# EAGLE schematic vr60 (EAGLE 9.6.2)

## Sheet 1 of 2
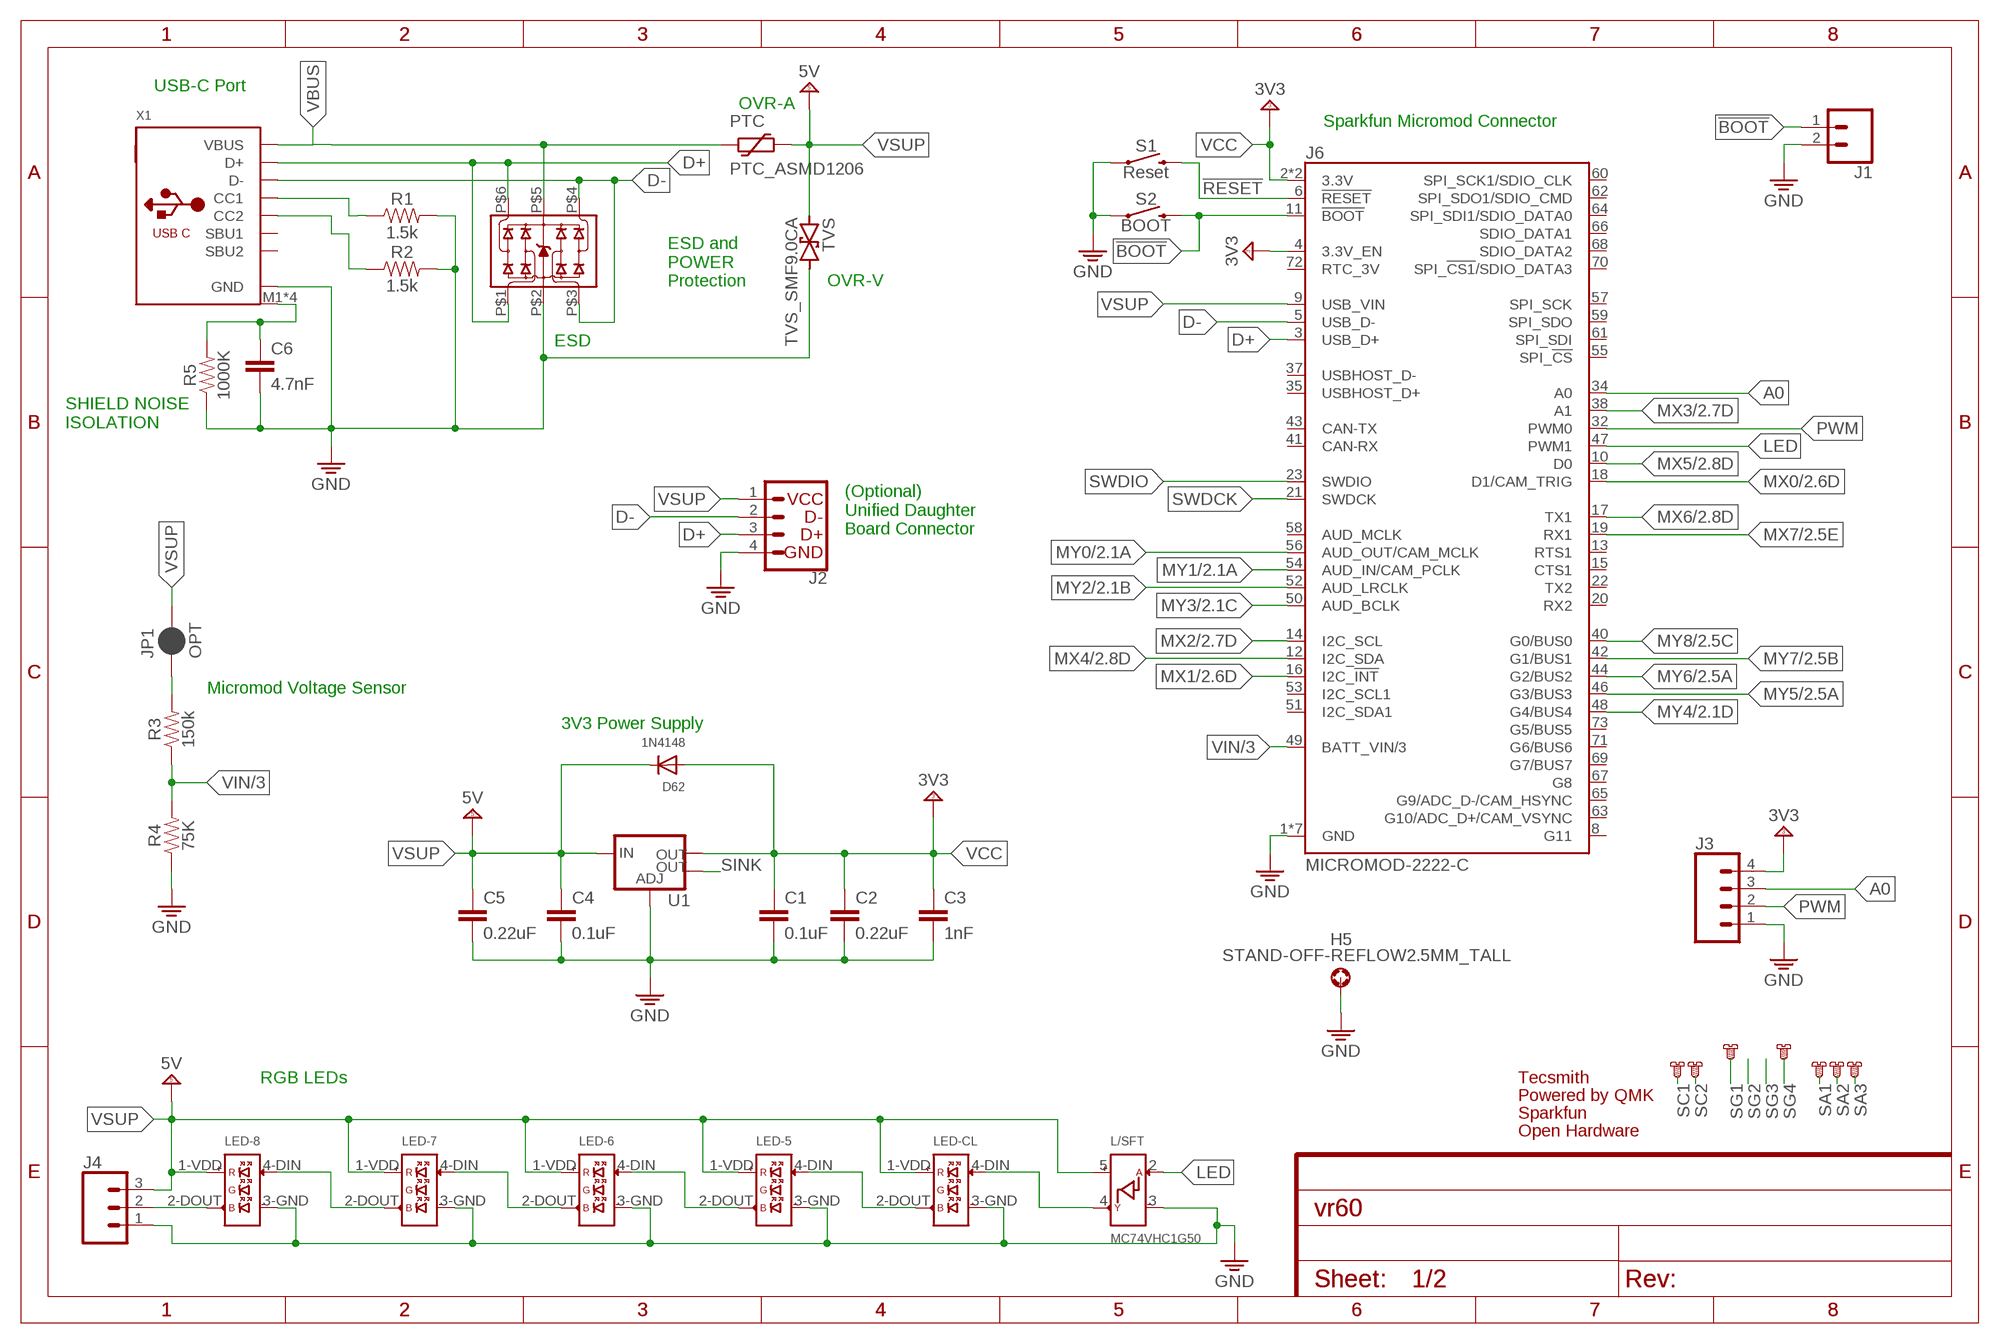
[diagram p0: schematic, sheet 1]

### Parts
C1  0.1uF  0.1UF-0603-25V-5%  [0603]
C2  0.22uF  0.22UF-0603-25V-10%  [0603]
C3  1nF  1.0NF/1000PF-0603-50V-10%  [0603]
C4  0.1uF  0.1UF-0603-25V-5%  [0603]
C5  0.22uF  0.22UF-0603-25V-10%  [0603]
C6  4.7nF  0.1UF-0603-25V-5%  [0603]
D62  1N4148  DIODESOD-123  [SOD-123]
ESD  ESD_SRV05-4  [SOT-23-6L]
H5  STAND-OFF-REFLOW2.5MM_TALL  [STAND-OFF-REFLOW-M2.5]
J1  CONN_02  [1X02]
J2  C3_UNIFIEDJS-1MM  [1X04_1MM_RA]
J3  CONN_04  [1X04]
J4  CONN_03  [1X03]
J6  MICROMOD-2222-C  [M.2-CONNECTOR-E]
JP1  OPT  JUMPER-SMT_2_NC_PASTE_NO-SILK  [SMT-JUMPER_2_NC_PASTE_NO-SILK]
L/SFT  MC74VHC1G50  [SC-74A]
LED-5  SK6812-E-REVERSE  [SK6812-E-MILL]
LED-6  SK6812-E-REVERSE  [SK6812-E-MILL]
LED-7  SK6812-E-REVERSE  [SK6812-E-MILL]
LED-8  SK6812-E-REVERSE  [SK6812-E-MILL]
LED-CL  SK6812-E-REVERSE  [SK6812-E-MILL]
LOGO1  OSHW-LOGOL  [OSHW-LOGO-L]
PTC  PTC_ASMD1206  [SMD_PTC]
R1  1.5k  1.5KOHM-0603-1/10W-1%  [0603]
R2  1.5k  1.5KOHM-0603-1/10W-1%  [0603]
R3  150k  150KOHM-0603-1/10W-1%  [0603]
R4  75K  75KOHM-0603-1/10W-1%  [0603]
R5  1000K  75KOHM-0603-1/10W-1%  [0603]
S1  Reset  MOMENTARY-SWITCH-SPST-SMD-5.2-TALL-REDUNDANT  [TACTILE_SWITCH_SMD_5.2MM]
S2  BOOT  MOMENTARY-SWITCH-SPST-SMD-5.2-TALL-REDUNDANT  [TACTILE_SWITCH_SMD_5.2MM]
SA1  MOUNTING-HOLE-WIDE  [MOUNTING-HOLE-WIDE]
SA2  MOUNTING-HOLE-WIDE  [MOUNTING-HOLE-WIDE]
SA3  MOUNTING-HOLE-WIDE  [MOUNTING-HOLE-WIDE]
SC1  MOUNTING-HOLE  [MOUNTING-HOLE]
SC2  MOUNTING-HOLE-WIDE  [MOUNTING-HOLE-WIDE]
SG1  MOUNTING-HOLE-VWIDEEDGE-CUT  [MOUNTING-HOLE-VWIDE-C]
SG4  MOUNTING-HOLE-VWIDEEDGE-CUT  [MOUNTING-HOLE-VWIDE-C]
TVS  TVS_SMF9.0CA  [SOD123FL-BI]
U1  V_REG_LM1117SOT223  [SOT223]
U$5  SPARKFUN_LOGO0.2  [SFE_LOGO_NAME_FLAME_.2]
U$6  QMK_LOGO  [QMK_LOGO]
U$8  TECSMITH-LOGOLONG  [TECSMITH-NAME]
X1  USB_C  [USB_C_CUSB31-CFM2AX-01-X]

### Nets
!BOOT: J1.1 J6.11(!BOOT!) S2.3 S2.4
!RESET: J6.6(!RESET!) S1.3 S1.4
A0: J3.3 J6.34(A0)
D+: ESD.P$1 ESD.P$6 J2.3(D+) J6.3(USB_D+) X1.A6(D+) X1.B6(D+)
D-: ESD.P$3 ESD.P$4 J2.2(D-) J6.5(USB_D-) X1.A7(D-) X1.B7(D-)
GND: C1.2 C2.2 C3.2 C4.2 C5.2 C6.2 ESD.P$2 H5.1 J1.2 J2.4(GND) J3.1 J4.1 J6.1(GND) J6.7(GND) J6.33(GND) J6.36(GND) J6.39(GND) J6.45(GND) J6.75(GND) L/SFT.3(3_GND) LED-5.3-GND(3_GND) LED-6.3-GND(3_GND) LED-7.3-GND(3_GND) LED-8.3-GND(3_GND) LED-CL.3-GND(3_GND) R1.2 R2.2 R4.1 R5.1 S1.1 S1.2 S2.1 S2.2 TVS.P$2 U1.1(ADJ) X1.A1B12(GND) X1.B1A12(GND)
LED: J6.47(PWM1) L/SFT.2(A_DIN)
MX0: J6.18(D1/CAM_TRIG) ; also sheet 2
MX1: J6.16(I2C_!INT!) ; also sheet 2
MX2: J6.14(I2C_SCL) ; also sheet 2
MX3: J6.38(A1) ; also sheet 2
MX4: J6.12(I2C_SDA) ; also sheet 2
MX5: J6.10(D0) ; also sheet 2
MX6: J6.17(TX1) ; also sheet 2
MX7: J6.19(RX1) ; also sheet 2
MY0: J6.56(AUD_OUT/CAM_MCLK) ; also sheet 2
MY1: J6.54(AUD_IN/CAM_PCLK) ; also sheet 2
MY2: J6.52(AUD_LRCLK) ; also sheet 2
MY3: J6.50(AUD_BCLK) ; also sheet 2
MY4: J6.48(G4/BUS4) ; also sheet 2
MY5: J6.46(G3/BUS3) ; also sheet 2
MY6: J6.44(G2/BUS2) ; also sheet 2
MY7: J6.42(G1/BUS1) ; also sheet 2
MY8: J6.40(G0/BUS0) ; also sheet 2
N$29: LED-5.4-DIN(4_DIN) LED-CL.2-DOUT(2_DOUT)
N$63: LED-5.2-DOUT(2_DOUT) LED-6.4-DIN(4_DIN)
N$64: LED-6.2-DOUT(2_DOUT) LED-7.4-DIN(4_DIN)
N$65: LED-7.2-DOUT(2_DOUT) LED-8.4-DIN(4_DIN)
N$67: R1.1 X1.A5(CC1)
N$68: JP1.1 R3.2
N$69: R2.1 X1.B5(CC2)
N$70: L/SFT.4(Y_DOUT) LED-CL.4-DIN(4_DIN)
N$71: C6.1 R5.2 X1.M1(SHIELD) X1.M2(SHIELD) X1.M3(SHIELD) X1.M4(SHIELD)
N$72: J4.2 LED-8.2-DOUT(2_DOUT)
PWM: J3.2 J6.32(PWM0)
SA1: SA1.P$2 SA1.P$3 SA1.P$4 SA1.P$5 SA1.P$7 SA1.P$8 SA1.P$9 SA1.P$10
SA2: SA2.P$2 SA2.P$3 SA2.P$4 SA2.P$5 SA2.P$7 SA2.P$8 SA2.P$9 SA2.P$10
SA3: SA3.P$2 SA3.P$3 SA3.P$4 SA3.P$5 SA3.P$7 SA3.P$8 SA3.P$9 SA3.P$10
SC1: SC1.P$2 SC1.P$3 SC1.P$7 SC1.P$8 SC1.P$9 SC1.P$10
SC2: SC2.P$2 SC2.P$3 SC2.P$4 SC2.P$5 SC2.P$7 SC2.P$8 SC2.P$9 SC2.P$10
SG1: SG1.P$1 SG1.P$4 SG1.P$5 SG1.P$6 SG1.P$7 SG1.P$8
SG4: SG4.P$1 SG4.P$4 SG4.P$5 SG4.P$6 SG4.P$7 SG4.P$8
SINK: U1.4(OUT)
SWDCK: J6.21(SWDCK)
SWDIO: J6.23(SWDIO)
VBUS: ESD.P$5 PTC.P$1 X1.A4B9(VBUS) X1.B4A9(VBUS)
VCC: C1.1 C2.1 C3.1 D62.A J3.4 J6.2(3.3V) J6.4(3.3V_EN) J6.74(3.3V) U1.2(OUT) ; supply symbol labelled 3V3
VIN/3: J6.49(BATT_VIN/3) R3.1 R4.2
VSUP: C4.1 C5.1 D62.C J2.1(VCC) J4.3 J6.9(USB_VIN) JP1.2 L/SFT.5(5_VCC) LED-5.1-VDD(1_VDD) LED-6.1-VDD(1_VDD) LED-7.1-VDD(1_VDD) LED-8.1-VDD(1_VDD) LED-CL.1-VDD(1_VDD) PTC.P$2 TVS.P$1 U1.3(IN) ; supply symbol labelled 5V
Unconnected: J6.8(G11) J6.13(RTS1) J6.15(CTS1) J6.20(RX2) J6.22(TX2) J6.35(USBHOST_D+) J6.37(USBHOST_D-) J6.41(CAN-RX) J6.43(CAN-TX) J6.51(I2C_SDA1) J6.53(I2C_SCL1) J6.55(SPI_!CS!) J6.57(SPI_SCK) J6.58(AUD_MCLK) J6.59(SPI_SDO) J6.60(SPI_SCK1/SDIO_CLK) J6.61(SPI_SDI) J6.62(SPI_SDO1/SDIO_CMD) J6.63(G10/ADC_D+/CAM_VSYNC) J6.64(SPI_SDI1/SDIO_DATA0) J6.65(G9/ADC_D-/CAM_HSYNC) J6.66(SDIO_DATA1) J6.67(G8) J6.68(SDIO_DATA2) J6.69(G7/BUS7) J6.70(SPI_!CS1!/SDIO_DATA3) J6.71(G6/BUS6) J6.72(RTC_3V) J6.73(G5/BUS5) X1.A8(SBU1) X1.B8(SBU2)

### Notes on the sheet
- USB-C Port
- OVR-A
- Sparkfun Micromod Connector
- ESD and
  POWER
  Protection
- OVR-V
- ESD
- SHIELD NOISE
  ISOLATION
- (Optional)
  Unified Daughter
  Board Connector
- Micromod Voltage Sensor
- 3V3 Power Supply
- RGB LEDs

## Sheet 2 of 2
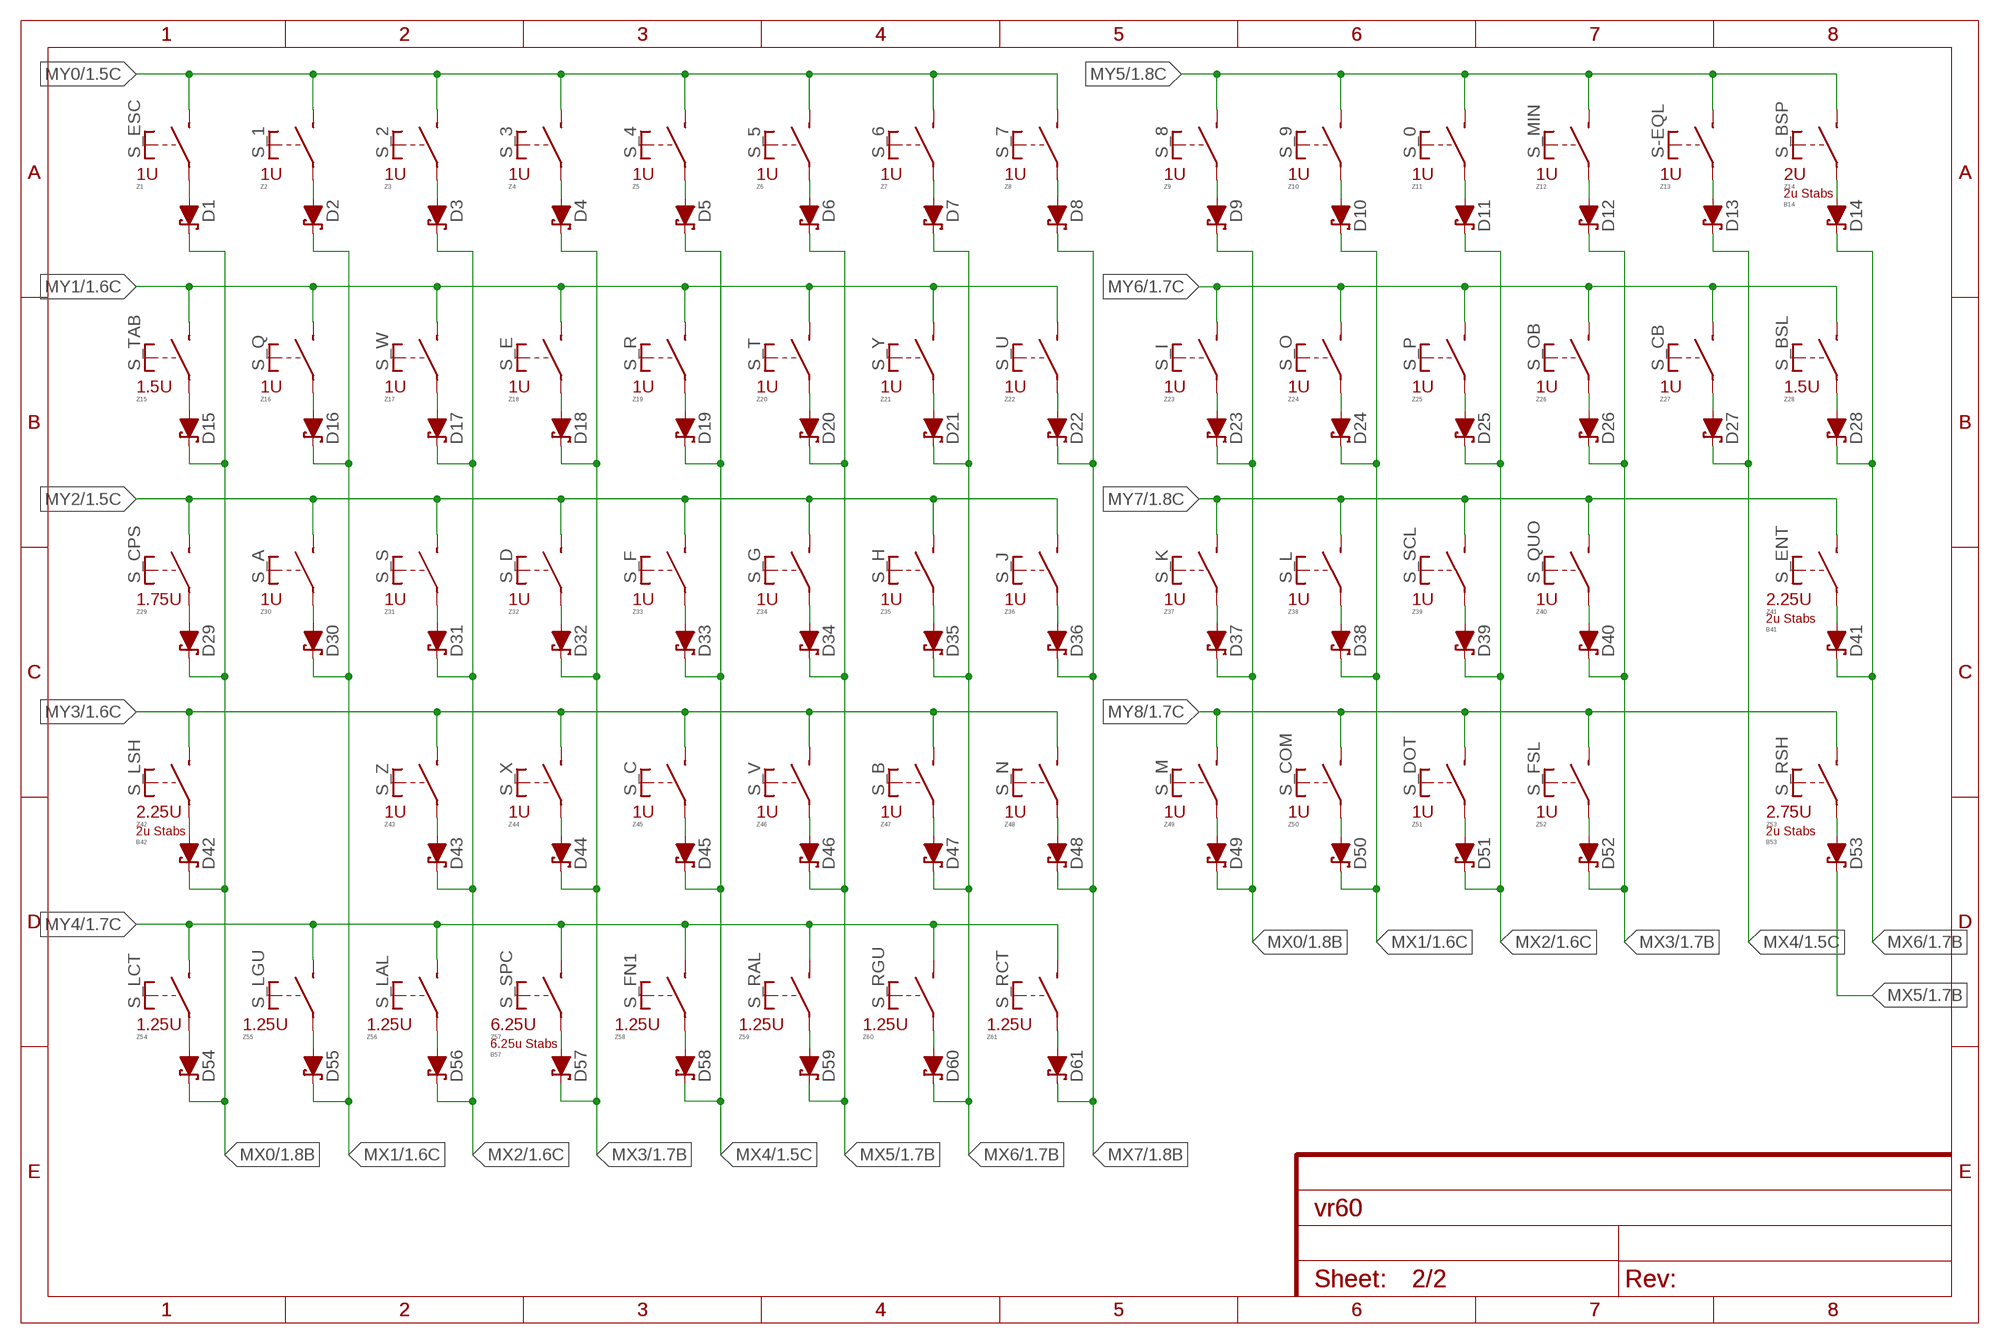
[diagram p1: schematic, sheet 2]

### Parts
B14  MX-STABS-200U  [MX-STABS-200U]
B41  MX-STABS-200U  [MX-STABS-200U]
B42  MX-STABS-200U  [MX-STABS-200U]
B53  MX-STABS-200U  [MX-STABS-200U]
B57  MX-STABS-625U  [MX-STABS-625U]
D1  1N5819WS  [SOD-123]
D2  1N5819WS  [SOD-123]
D3  1N5819WS  [SOD-123]
D4  1N5819WS  [SOD-123]
D5  1N5819WS  [SOD-123]
D6  1N5819WS  [SOD-123]
D7  1N5819WS  [SOD-123]
D8  1N5819WS  [SOD-123]
D9  1N5819WS  [SOD-123]
D10  1N5819WS  [SOD-123]
D11  1N5819WS  [SOD-123]
D12  1N5819WS  [SOD-123]
D13  1N5819WS  [SOD-123]
D14  1N5819WS  [SOD-123]
D15  1N5819WS  [SOD-123]
D16  1N5819WS  [SOD-123]
D17  1N5819WS  [SOD-123]
D18  1N5819WS  [SOD-123]
D19  1N5819WS  [SOD-123]
D20  1N5819WS  [SOD-123]
D21  1N5819WS  [SOD-123]
D22  1N5819WS  [SOD-123]
D23  1N5819WS  [SOD-123]
D24  1N5819WS  [SOD-123]
D25  1N5819WS  [SOD-123]
D26  1N5819WS  [SOD-123]
D27  1N5819WS  [SOD-123]
D28  1N5819WS  [SOD-123]
D29  1N5819WS  [SOD-123]
D30  1N5819WS  [SOD-123]
D31  1N5819WS  [SOD-123]
D32  1N5819WS  [SOD-123]
D33  1N5819WS  [SOD-123]
D34  1N5819WS  [SOD-123]
D35  1N5819WS  [SOD-123]
D36  1N5819WS  [SOD-123]
D37  1N5819WS  [SOD-123]
D38  1N5819WS  [SOD-123]
D39  1N5819WS  [SOD-123]
D40  1N5819WS  [SOD-123]
D41  1N5819WS  [SOD-123]
D42  1N5819WS  [SOD-123]
D43  1N5819WS  [SOD-123]
D44  1N5819WS  [SOD-123]
D45  1N5819WS  [SOD-123]
D46  1N5819WS  [SOD-123]
D47  1N5819WS  [SOD-123]
D48  1N5819WS  [SOD-123]
D49  1N5819WS  [SOD-123]
D50  1N5819WS  [SOD-123]
D51  1N5819WS  [SOD-123]
D52  1N5819WS  [SOD-123]
D53  1N5819WS  [SOD-123]
D54  1N5819WS  [SOD-123]
D55  1N5819WS  [SOD-123]
D56  1N5819WS  [SOD-123]
D57  1N5819WS  [SOD-123]
D58  1N5819WS  [SOD-123]
D59  1N5819WS  [SOD-123]
D60  1N5819WS  [SOD-123]
D61  1N5819WS  [SOD-123]
S-EQL  MX-5-PIN-HOTSWAP-PAD  [MX-5-PIN-HOTSWAP-PAD]
S_0  MX-5-PIN-HOTSWAP-PAD  [MX-5-PIN-HOTSWAP-PAD]
S_1  MX-5-PIN-HOTSWAP-PAD  [MX-5-PIN-HOTSWAP-PAD]
S_2  MX-5-PIN-HOTSWAP-PAD  [MX-5-PIN-HOTSWAP-PAD]
S_3  MX-5-PIN-HOTSWAP-PAD  [MX-5-PIN-HOTSWAP-PAD]
S_4  MX-5-PIN-HOTSWAP-PAD  [MX-5-PIN-HOTSWAP-PAD]
S_5  MX-5-PIN-HOTSWAP-PAD  [MX-5-PIN-HOTSWAP-PAD]
S_6  MX-5-PIN-HOTSWAP-PAD  [MX-5-PIN-HOTSWAP-PAD]
S_7  MX-5-PIN-HOTSWAP-PAD  [MX-5-PIN-HOTSWAP-PAD]
S_8  MX-5-PIN-HOTSWAP-PAD  [MX-5-PIN-HOTSWAP-PAD]
S_9  MX-5-PIN-HOTSWAP-PAD  [MX-5-PIN-HOTSWAP-PAD]
S_A  MX-5-PIN-HOTSWAP-PAD  [MX-5-PIN-HOTSWAP-PAD]
S_B  MX-5-PIN-HOTSWAP-PAD  [MX-5-PIN-HOTSWAP-PAD]
S_BSL  MX-5-PIN-HOTSWAP-PAD  [MX-5-PIN-HOTSWAP-PAD]
S_BSP  MX-5-PIN-HOTSWAP-PAD  [MX-5-PIN-HOTSWAP-PAD]
S_C  MX-5-PIN-HOTSWAP-PAD  [MX-5-PIN-HOTSWAP-PAD]
S_CB  MX-5-PIN-HOTSWAP-PAD  [MX-5-PIN-HOTSWAP-PAD]
S_COM  MX-5-PIN-HOTSWAP-PAD  [MX-5-PIN-HOTSWAP-PAD]
S_CPS  MX-5-PIN-HOTSWAP-PAD  [MX-5-PIN-HOTSWAP-PAD]
S_D  MX-5-PIN-HOTSWAP-PAD  [MX-5-PIN-HOTSWAP-PAD]
S_DOT  MX-5-PIN-HOTSWAP-PAD  [MX-5-PIN-HOTSWAP-PAD]
S_E  MX-5-PIN-HOTSWAP-PAD  [MX-5-PIN-HOTSWAP-PAD]
S_ENT  MX-5-PIN-HOTSWAP-PAD  [MX-5-PIN-HOTSWAP-PAD]
S_ESC  MX-5-PIN-HOTSWAP-PAD  [MX-5-PIN-HOTSWAP-PAD]
S_F  MX-5-PIN-HOTSWAP-PAD  [MX-5-PIN-HOTSWAP-PAD]
S_FN1  MX-5-PIN-HOTSWAP-PAD  [MX-5-PIN-HOTSWAP-PAD]
S_FSL  MX-5-PIN-HOTSWAP-PAD  [MX-5-PIN-HOTSWAP-PAD]
S_G  MX-5-PIN-HOTSWAP-PAD  [MX-5-PIN-HOTSWAP-PAD]
S_H  MX-5-PIN-HOTSWAP-PAD  [MX-5-PIN-HOTSWAP-PAD]
S_I  MX-5-PIN-HOTSWAP-PAD  [MX-5-PIN-HOTSWAP-PAD]
S_J  MX-5-PIN-HOTSWAP-PAD  [MX-5-PIN-HOTSWAP-PAD]
S_K  MX-5-PIN-HOTSWAP-PAD  [MX-5-PIN-HOTSWAP-PAD]
S_L  MX-5-PIN-HOTSWAP-PAD  [MX-5-PIN-HOTSWAP-PAD]
S_LAL  MX-5-PIN-HOTSWAP-PAD  [MX-5-PIN-HOTSWAP-PAD]
S_LCT  MX-5-PIN-HOTSWAP-PAD  [MX-5-PIN-HOTSWAP-PAD]
S_LGU  MX-5-PIN-HOTSWAP-PAD  [MX-5-PIN-HOTSWAP-PAD]
S_LSH  MX-5-PIN-HOTSWAP-PAD  [MX-5-PIN-HOTSWAP-PAD]
S_M  MX-5-PIN-HOTSWAP-PAD  [MX-5-PIN-HOTSWAP-PAD]
S_MIN  MX-5-PIN-HOTSWAP-PAD  [MX-5-PIN-HOTSWAP-PAD]
S_N  MX-5-PIN-HOTSWAP-PAD  [MX-5-PIN-HOTSWAP-PAD]
S_O  MX-5-PIN-HOTSWAP-PAD  [MX-5-PIN-HOTSWAP-PAD]
S_OB  MX-5-PIN-HOTSWAP-PAD  [MX-5-PIN-HOTSWAP-PAD]
S_P  MX-5-PIN-HOTSWAP-PAD  [MX-5-PIN-HOTSWAP-PAD]
S_Q  MX-5-PIN-HOTSWAP-PAD  [MX-5-PIN-HOTSWAP-PAD]
S_QUO  MX-5-PIN-HOTSWAP-PAD  [MX-5-PIN-HOTSWAP-PAD]
S_R  MX-5-PIN-HOTSWAP-PAD  [MX-5-PIN-HOTSWAP-PAD]
S_RAL  MX-5-PIN-HOTSWAP-PAD  [MX-5-PIN-HOTSWAP-PAD]
S_RCT  MX-5-PIN-HOTSWAP-PAD  [MX-5-PIN-HOTSWAP-PAD]
S_RGU  MX-5-PIN-HOTSWAP-PAD  [MX-5-PIN-HOTSWAP-PAD]
S_RSH  MX-5-PIN-HOTSWAP-PAD  [MX-5-PIN-HOTSWAP-PAD]
S_S  MX-5-PIN-HOTSWAP-PAD  [MX-5-PIN-HOTSWAP-PAD]
S_SCL  MX-5-PIN-HOTSWAP-PAD  [MX-5-PIN-HOTSWAP-PAD]
S_SPC  MX-5-PIN-HOTSWAP-PAD  [MX-5-PIN-HOTSWAP-PAD]
S_T  MX-5-PIN-HOTSWAP-PAD  [MX-5-PIN-HOTSWAP-PAD]
S_TAB  MX-5-PIN-HOTSWAP-PAD  [MX-5-PIN-HOTSWAP-PAD]
S_U  MX-5-PIN-HOTSWAP-PAD  [MX-5-PIN-HOTSWAP-PAD]
S_V  MX-5-PIN-HOTSWAP-PAD  [MX-5-PIN-HOTSWAP-PAD]
S_W  MX-5-PIN-HOTSWAP-PAD  [MX-5-PIN-HOTSWAP-PAD]
S_X  MX-5-PIN-HOTSWAP-PAD  [MX-5-PIN-HOTSWAP-PAD]
S_Y  MX-5-PIN-HOTSWAP-PAD  [MX-5-PIN-HOTSWAP-PAD]
S_Z  MX-5-PIN-HOTSWAP-PAD  [MX-5-PIN-HOTSWAP-PAD]
Z1  MX-FPRINT-100U19  [MX-FPRINT-1900-100U]
Z2  MX-FPRINT-100U19  [MX-FPRINT-1900-100U]
Z3  MX-FPRINT-100U19  [MX-FPRINT-1900-100U]
Z4  MX-FPRINT-100U19  [MX-FPRINT-1900-100U]
Z5  MX-FPRINT-100U19  [MX-FPRINT-1900-100U]
Z6  MX-FPRINT-100U19  [MX-FPRINT-1900-100U]
Z7  MX-FPRINT-100U19  [MX-FPRINT-1900-100U]
Z8  MX-FPRINT-100U19  [MX-FPRINT-1900-100U]
Z9  MX-FPRINT-100U19  [MX-FPRINT-1900-100U]
Z10  MX-FPRINT-100U19  [MX-FPRINT-1900-100U]
Z11  MX-FPRINT-100U19  [MX-FPRINT-1900-100U]
Z12  MX-FPRINT-100U19  [MX-FPRINT-1900-100U]
Z13  MX-FPRINT-100U19  [MX-FPRINT-1900-100U]
Z14  MX-FPRINT-200U19  [MX-FPRINT-1900-200U]
Z15  MX-FPRINT-150U19  [MX-FPRINT-1900-150U]
Z16  MX-FPRINT-100U19  [MX-FPRINT-1900-100U]
Z17  MX-FPRINT-100U19  [MX-FPRINT-1900-100U]
Z18  MX-FPRINT-100U19  [MX-FPRINT-1900-100U]
Z19  MX-FPRINT-100U19  [MX-FPRINT-1900-100U]
Z20  MX-FPRINT-100U19  [MX-FPRINT-1900-100U]
Z21  MX-FPRINT-100U19  [MX-FPRINT-1900-100U]
Z22  MX-FPRINT-100U19  [MX-FPRINT-1900-100U]
Z23  MX-FPRINT-100U19  [MX-FPRINT-1900-100U]
Z24  MX-FPRINT-100U19  [MX-FPRINT-1900-100U]
Z25  MX-FPRINT-100U19  [MX-FPRINT-1900-100U]
Z26  MX-FPRINT-100U19  [MX-FPRINT-1900-100U]
Z27  MX-FPRINT-100U19  [MX-FPRINT-1900-100U]
Z28  MX-FPRINT-150U19  [MX-FPRINT-1900-150U]
Z29  MX-FPRINT-175U19  [MX-FPRINT-1900-175U]
Z30  MX-FPRINT-100U19  [MX-FPRINT-1900-100U]
Z31  MX-FPRINT-100U19  [MX-FPRINT-1900-100U]
Z32  MX-FPRINT-100U19  [MX-FPRINT-1900-100U]
Z33  MX-FPRINT-100U19  [MX-FPRINT-1900-100U]
Z34  MX-FPRINT-100U19  [MX-FPRINT-1900-100U]
Z35  MX-FPRINT-100U19  [MX-FPRINT-1900-100U]
Z36  MX-FPRINT-100U19  [MX-FPRINT-1900-100U]
Z37  MX-FPRINT-100U19  [MX-FPRINT-1900-100U]
Z38  MX-FPRINT-100U19  [MX-FPRINT-1900-100U]
Z39  MX-FPRINT-100U19  [MX-FPRINT-1900-100U]
Z40  MX-FPRINT-100U19  [MX-FPRINT-1900-100U]
Z41  MX-FPRINT-225U19  [MX-FPRINT-1900-225U]
Z42  MX-FPRINT-225U19  [MX-FPRINT-1900-225U]
Z43  MX-FPRINT-100U19  [MX-FPRINT-1900-100U]
Z44  MX-FPRINT-100U19  [MX-FPRINT-1900-100U]
Z45  MX-FPRINT-100U19  [MX-FPRINT-1900-100U]
Z46  MX-FPRINT-100U19  [MX-FPRINT-1900-100U]
Z47  MX-FPRINT-100U19  [MX-FPRINT-1900-100U]
Z48  MX-FPRINT-100U19  [MX-FPRINT-1900-100U]
Z49  MX-FPRINT-100U19  [MX-FPRINT-1900-100U]
Z50  MX-FPRINT-100U19  [MX-FPRINT-1900-100U]
Z51  MX-FPRINT-100U19  [MX-FPRINT-1900-100U]
Z52  MX-FPRINT-100U19  [MX-FPRINT-1900-100U]
Z53  MX-FPRINT-275U19  [MX-FPRINT-1900-275U]
Z54  MX-FPRINT-125U19  [MX-FPRINT-1900-125U]
Z55  MX-FPRINT-125U19  [MX-FPRINT-1900-125U]
Z56  MX-FPRINT-125U19  [MX-FPRINT-1900-125U]
Z57  MX-FPRINT-625U19  [MX-FPRINT-1900-625U]
Z58  MX-FPRINT-125U19  [MX-FPRINT-1900-125U]
Z59  MX-FPRINT-125U19  [MX-FPRINT-1900-125U]
Z60  MX-FPRINT-125U19  [MX-FPRINT-1900-125U]
Z61  MX-FPRINT-125U19  [MX-FPRINT-1900-125U]

### Nets
MX0: D1.C D9.C D15.C D23.C D29.C D37.C D42.C D49.C D54.C ; also sheet 1
MX1: D2.C D10.C D16.C D24.C D30.C D38.C D50.C D55.C ; also sheet 1
MX2: D3.C D11.C D17.C D25.C D31.C D39.C D43.C D51.C D56.C ; also sheet 1
MX3: D4.C D12.C D18.C D26.C D32.C D40.C D44.C D52.C D57.C ; also sheet 1
MX4: D5.C D13.C D19.C D27.C D33.C D45.C D58.C ; also sheet 1
MX5: D6.C D20.C D34.C D46.C D53.C D59.C ; also sheet 1
MX6: D7.C D14.C D21.C D28.C D35.C D41.C D47.C D60.C ; also sheet 1
MX7: D8.C D22.C D36.C D48.C D61.C ; also sheet 1
MY0: S_1.P$2(S) S_1.P$4(S) S_2.P$2(S) S_2.P$4(S) S_3.P$2(S) S_3.P$4(S) S_4.P$2(S) S_4.P$4(S) S_5.P$2(S) S_5.P$4(S) S_6.P$2(S) S_6.P$4(S) S_7.P$2(S) S_7.P$4(S) S_ESC.P$2(S) S_ESC.P$4(S) ; also sheet 1
MY1: S_E.P$2(S) S_E.P$4(S) S_Q.P$2(S) S_Q.P$4(S) S_R.P$2(S) S_R.P$4(S) S_T.P$2(S) S_T.P$4(S) S_TAB.P$2(S) S_TAB.P$4(S) S_U.P$2(S) S_U.P$4(S) S_W.P$2(S) S_W.P$4(S) S_Y.P$2(S) S_Y.P$4(S) ; also sheet 1
MY2: S_A.P$2(S) S_A.P$4(S) S_CPS.P$2(S) S_CPS.P$4(S) S_D.P$2(S) S_D.P$4(S) S_F.P$2(S) S_F.P$4(S) S_G.P$2(S) S_G.P$4(S) S_H.P$2(S) S_H.P$4(S) S_J.P$2(S) S_J.P$4(S) S_S.P$2(S) S_S.P$4(S) ; also sheet 1
MY3: S_B.P$2(S) S_B.P$4(S) S_C.P$2(S) S_C.P$4(S) S_LSH.P$2(S) S_LSH.P$4(S) S_N.P$2(S) S_N.P$4(S) S_V.P$2(S) S_V.P$4(S) S_X.P$2(S) S_X.P$4(S) S_Z.P$2(S) S_Z.P$4(S) ; also sheet 1
MY4: S_FN1.P$2(S) S_FN1.P$4(S) S_LAL.P$2(S) S_LAL.P$4(S) S_LCT.P$2(S) S_LCT.P$4(S) S_LGU.P$2(S) S_LGU.P$4(S) S_RAL.P$2(S) S_RAL.P$4(S) S_RCT.P$2(S) S_RCT.P$4(S) S_RGU.P$2(S) S_RGU.P$4(S) S_SPC.P$2(S) S_SPC.P$4(S) ; also sheet 1
MY5: S-EQL.P$2(S) S-EQL.P$4(S) S_0.P$2(S) S_0.P$4(S) S_8.P$2(S) S_8.P$4(S) S_9.P$2(S) S_9.P$4(S) S_BSP.P$2(S) S_BSP.P$4(S) S_MIN.P$2(S) S_MIN.P$4(S) ; also sheet 1
MY6: S_BSL.P$2(S) S_BSL.P$4(S) S_CB.P$2(S) S_CB.P$4(S) S_I.P$2(S) S_I.P$4(S) S_O.P$2(S) S_O.P$4(S) S_OB.P$2(S) S_OB.P$4(S) S_P.P$2(S) S_P.P$4(S) ; also sheet 1
MY7: S_ENT.P$2(S) S_ENT.P$4(S) S_K.P$2(S) S_K.P$4(S) S_L.P$2(S) S_L.P$4(S) S_QUO.P$2(S) S_QUO.P$4(S) S_SCL.P$2(S) S_SCL.P$4(S) ; also sheet 1
MY8: S_COM.P$2(S) S_COM.P$4(S) S_DOT.P$2(S) S_DOT.P$4(S) S_FSL.P$2(S) S_FSL.P$4(S) S_M.P$2(S) S_M.P$4(S) S_RSH.P$2(S) S_RSH.P$4(S) ; also sheet 1
N$1: D1.A S_ESC.P$1(P) S_ESC.P$3(P)
N$2: D2.A S_1.P$1(P) S_1.P$3(P)
N$3: D3.A S_2.P$1(P) S_2.P$3(P)
N$4: D4.A S_3.P$1(P) S_3.P$3(P)
N$5: D5.A S_4.P$1(P) S_4.P$3(P)
N$6: D6.A S_5.P$1(P) S_5.P$3(P)
N$7: D7.A S_6.P$1(P) S_6.P$3(P)
N$8: D8.A S_7.P$1(P) S_7.P$3(P)
N$9: D9.A S_8.P$1(P) S_8.P$3(P)
N$10: D10.A S_9.P$1(P) S_9.P$3(P)
N$11: D11.A S_0.P$1(P) S_0.P$3(P)
N$12: D12.A S_MIN.P$1(P) S_MIN.P$3(P)
N$13: D13.A S-EQL.P$1(P) S-EQL.P$3(P)
N$14: D14.A S_BSP.P$1(P) S_BSP.P$3(P)
N$15: D15.A S_TAB.P$1(P) S_TAB.P$3(P)
N$16: D16.A S_Q.P$1(P) S_Q.P$3(P)
N$17: D17.A S_W.P$1(P) S_W.P$3(P)
N$18: D18.A S_E.P$1(P) S_E.P$3(P)
N$19: D19.A S_R.P$1(P) S_R.P$3(P)
N$20: D20.A S_T.P$1(P) S_T.P$3(P)
N$21: D21.A S_Y.P$1(P) S_Y.P$3(P)
N$22: D22.A S_U.P$1(P) S_U.P$3(P)
N$23: D23.A S_I.P$1(P) S_I.P$3(P)
N$24: D24.A S_O.P$1(P) S_O.P$3(P)
N$25: D25.A S_P.P$1(P) S_P.P$3(P)
N$26: D26.A S_OB.P$1(P) S_OB.P$3(P)
N$27: D27.A S_CB.P$1(P) S_CB.P$3(P)
N$28: D28.A S_BSL.P$1(P) S_BSL.P$3(P)
N$30: D30.A S_A.P$1(P) S_A.P$3(P)
N$31: D31.A S_S.P$1(P) S_S.P$3(P)
N$32: D32.A S_D.P$1(P) S_D.P$3(P)
N$33: D33.A S_F.P$1(P) S_F.P$3(P)
N$34: D34.A S_G.P$1(P) S_G.P$3(P)
N$35: D35.A S_H.P$1(P) S_H.P$3(P)
N$36: D36.A S_J.P$1(P) S_J.P$3(P)
N$37: D37.A S_K.P$1(P) S_K.P$3(P)
N$38: D38.A S_L.P$1(P) S_L.P$3(P)
N$39: D39.A S_SCL.P$1(P) S_SCL.P$3(P)
N$40: D40.A S_QUO.P$1(P) S_QUO.P$3(P)
N$41: D41.A S_ENT.P$1(P) S_ENT.P$3(P)
N$42: D42.A S_LSH.P$1(P) S_LSH.P$3(P)
N$43: D43.A S_Z.P$1(P) S_Z.P$3(P)
N$44: D44.A S_X.P$1(P) S_X.P$3(P)
N$45: D45.A S_C.P$1(P) S_C.P$3(P)
N$46: D46.A S_V.P$1(P) S_V.P$3(P)
N$47: D47.A S_B.P$1(P) S_B.P$3(P)
N$48: D48.A S_N.P$1(P) S_N.P$3(P)
N$49: D49.A S_M.P$1(P) S_M.P$3(P)
N$50: D50.A S_COM.P$1(P) S_COM.P$3(P)
N$51: D51.A S_DOT.P$1(P) S_DOT.P$3(P)
N$52: D52.A S_FSL.P$1(P) S_FSL.P$3(P)
N$53: D53.A S_RSH.P$1(P) S_RSH.P$3(P)
N$54: D54.A S_LCT.P$1(P) S_LCT.P$3(P)
N$55: D55.A S_LGU.P$1(P) S_LGU.P$3(P)
N$56: D56.A S_LAL.P$1(P) S_LAL.P$3(P)
N$57: D57.A S_SPC.P$1(P) S_SPC.P$3(P)
N$58: D58.A S_FN1.P$1(P) S_FN1.P$3(P)
N$59: D59.A S_RAL.P$1(P) S_RAL.P$3(P)
N$60: D60.A S_RGU.P$1(P) S_RGU.P$3(P)
N$61: D61.A S_RCT.P$1(P) S_RCT.P$3(P)
N$62: D29.A S_CPS.P$1(P) S_CPS.P$3(P)

## Library data of the parts
B14 B41 B42 B53 = ts_keyboards:MX-STABS-200U
B57 = ts_keyboards:MX-STABS-625U
C1 C4 = SparkFun-Capacitors:0.1UF: 0.1µF ceramic capacitors A capacitor is a passive two-terminal electrical component used to store electrical energy temporarily in an electric field.; PROD_ID: CAP-08604
C2 C5 = SparkFun-Capacitors:0.22UF: 0.22µF ceramic capacitors A capacitor is a passive two-terminal electrical component used to store electrical energy temporarily in an electric field.; PROD_ID: CAP-07822
C3 = SparkFun-Capacitors:1.0NF/1000PF: 1nF/1,000pF ceramic capacitors A capacitor is a passive two-terminal electrical component used to store electrical energy temporarily in an electric field.; PROD_ID: CAP-07886
C6 = SparkFun-Capacitors:0.1UF: 0.1µF ceramic capacitors A capacitor is a passive two-terminal electrical component used to store electrical energy temporarily in an electric field.; PROD_ID: CAP-08604; VALUE: 0.1uF
D1-D61 = jlcpcb_basic_parts:1N5819WS: JLCPCB Part # C8598 Description 40V 600mV@1A 1A SOD-123 Schottky Barrier Diodes (SBD) ROHS Schottky Diode
D62 = adafruit:DIODE: Diode SMADIODE - SMA Surface Mount Package 20V 1A Schottky Diode Digikey: 641-1014-6-ND DO-1N4148 - Through Hole Small Current Diode SOD-123 20V 1 A (.5mV Vf) Schottky Diode - Digikey: MBRX120TPMSCT-ND SOD-323 10V 570mA (.38mV Vf, 3ns) Schottky Diode - Digikey: ZLLS410CT-ND SOD-523 30V 30mA Schottky Diode (RB751S-40TE61) - Digikey: RB751S-40TE61CT-ND SOT23-R/W - SOT23 Package (R = Solder Paste/Reflow Ovens, W = Hand-Soldering) BAT54Film 40V 300mA - Digikey: 497-7162-1-ND
ESD = ts_keyboards:ESD_SRV05-4
H5 = SparkFun-Hardware:STAND-OFF-REFLOW: Stand Off Reflow Compatible A metal standoff that can be placed and reflowed onto a PCB.; PROD_ID: HW-14899
J1 = SparkFun-Connectors:CONN_02: Multi connection point. Often used as Generic Header-pin footprint for 0.1 inch spaced/style header connections On any of the 0.1 inch spaced packages, you can populate with these: Break Away Headers - Straight <https://www.sparkfun.com/products/116> (PRT-00116) Break Away Male Headers - Right Angle <https://www.sparkfun.com/products/553> (PRT-00553) Female Headers <https://www.sparkfun.com/products/115> (PRT-00115) Break Away Headers - Machine Pin <https://www.sparkfun.com/products/117> (PRT-00117) Break Away Female Headers - Swiss Machine Pin <https://www.sparkfun.com/products/743> (PRT-00743) For SCREWTERMINALS and SPRING TERMINALS visit here: Screw Terimnals on SparkFun.com <https://www.sparkfun.com/search/results?term=Screw+Terminals> (5mm/3.5mm/2.54mm spacing) This device is also useful as a general connection point to wire up your design to another part of your project. Our various solder wires solder well into these plated through hole pads. Hook-Up Wire - Assortment (Stranded, 22 AWG) <https://www.sparkfun.com/products/11375> (PRT-11375) Hook-Up Wire - Assortment (Solid Core, 22 AWG) <https://www.sparkfun.com/products/11367> (PRT-11367) View the entire wire category on our website here <https://www.sparkfun.com/categories/141> Special notes: Molex polarized connector foot print use with: PRT-08233 with associated crimp pins and housings. 2.54_SCREWTERM for use with PRT-10571. 3.5mm Screw Terminal footprints for PRT-08084 5mm Screw Terminal footprints for use with PRT-08432
J2 = __untitled:C3_UNIFIED: SparkFun I2C Standard Qwiic Connector An SMD 1mm pitch JST connector makes it easy and quick (get it? Qwiic?) to connect I2C devices to each other. The Qwiic system <http://www.sparkfun.com/qwiic> enables fast and solderless connection between popular platforms and various sensors and actuators. We carry 200mm <https://www.sparkfun.com/products/14204>, 100mm <https://www.sparkfun.com/products/14205>, 50mm <https://www.sparkfun.com/products/14206>, and breadboard friendly <https://www.sparkfun.com/products/14207> Qwiic cables. We also offer 10 pcs strips <https://www.sparkfun.com/products/14323> the SMD connectors.
J3 = SparkFun-Connectors:CONN_04: Multi connection point. Often used as Generic Header-pin footprint for 0.1 inch spaced/style header connections On any of the 0.1 inch spaced packages, you can populate with these: Break Away Headers - Straight <https://www.sparkfun.com/products/116> (PRT-00116) Break Away Male Headers - Right Angle <https://www.sparkfun.com/products/553> (PRT-00553) Female Headers <https://www.sparkfun.com/products/115> (PRT-00115) Break Away Headers - Machine Pin <https://www.sparkfun.com/products/117> (PRT-00117) Break Away Female Headers - Swiss Machine Pin <https://www.sparkfun.com/products/743> (PRT-00743) For SCREWTERMINALS and SPRING TERMINALS visit here: Screw Terimnals on SparkFun.com <https://www.sparkfun.com/search/results?term=Screw+Terminals> (5mm/3.5mm/2.54mm spacing) This device is also useful as a general connection point to wire up your design to another part of your project. Our various solder wires solder well into these plated through hole pads. Hook-Up Wire - Assortment (Stranded, 22 AWG) <https://www.sparkfun.com/products/11375> (PRT-11375) Hook-Up Wire - Assortment (Solid Core, 22 AWG) <https://www.sparkfun.com/products/11367> (PRT-11367) View the entire wire category on our website here <https://www.sparkfun.com/categories/141> Special notes: Molex polarized connector foot print use with SKU : PRT-08231 with associated crimp pins and housings. 1MM SMD Version SKU: PRT-10208; PROD_ID: CONN-09696
J4 = SparkFun-Connectors:CONN_03: Multi connection point. Often used as Generic Header-pin footprint for 0.1 inch spaced/style header connections On any of the 0.1 inch spaced packages, you can populate with these: Break Away Headers - Straight <https://www.sparkfun.com/products/116> (PRT-00116) Break Away Male Headers - Right Angle <https://www.sparkfun.com/products/553> (PRT-00553) Female Headers <https://www.sparkfun.com/products/115> (PRT-00115) Break Away Headers - Machine Pin <https://www.sparkfun.com/products/117> (PRT-00117) Break Away Female Headers - Swiss Machine Pin <https://www.sparkfun.com/products/743> (PRT-00743) Stackable Header - 3 Pin (Female, 0.1") <https://www.sparkfun.com/products/13875> (PRT-13875) For SCREWTERMINALS and SPRING TERMINALS visit here: Screw Terimnals on SparkFun.com <https://www.sparkfun.com/search/results?term=Screw+Terminals> (5mm/3.5mm/2.54mm spacing) This device is also useful as a general connection point to wire up your design to another part of your project. Our various solder wires solder well into these plated through hole pads. Hook-Up Wire - Assortment (Stranded, 22 AWG) <https://www.sparkfun.com/products/11375> (PRT-11375) Hook-Up Wire - Assortment (Solid Core, 22 AWG) <https://www.sparkfun.com/products/11367> (PRT-11367) View the entire wire category on our website here <https://www.sparkfun.com/categories/141> Special notes: Molex polarized connector foot print use with SKU : PRT-08232 with associated crimp pins and housings.
J6 = SparkFun-MicroMod:MICROMOD: MicroMod Connector Description: A card edge connector and mating PCB connector to allow various MicroMod Processor Boards to be coupled with various carrier boards of different capabilities. Based on the M.2 standard.; PROD_ID: CONN-14877
JP1 = SparkFun-Jumpers:JUMPER-SMT_2_NC_PASTE: Normally closed solder jumper This jumper has an aperture in the stencil to allow solder paste to bridge the split in the wire so it's normally closed (NC). Wick off the solder to open the connection. Reapply solder to reclose the connection.
L/SFT = ts_keyboards:MC74VHC1G50: Level Shifter
LED-5-LED-8 LED-CL = ts_keyboards:SK6812-E-REVERSE
LOGO1 = random_logos:OSHW-LOGO: Open-Source Hardware (OSHW) Logo This logo indicates the piece of hardware it is found on incorporates a OSHW license and/or adheres to the definition of open source hardware found here: http://freedomdefined.org/OSHW
PTC = ts_keyboards:PTC_ASMD1206
R1 R2 = SparkFun-Resistors:1.5KOHM: 1.5kΩ resistor A resistor is a passive two-terminal electrical component that implements electrical resistance as a circuit element. Resistors act to reduce current flow, and, at the same time, act to lower voltage levels within circuits. - Wikipedia; PROD_ID: RES-08306
R3 = SparkFun-Resistors:150KOHM: 150kΩ resistor A resistor is a passive two-terminal electrical component that implements electrical resistance as a circuit element. Resistors act to reduce current flow, and, at the same time, act to lower voltage levels within circuits. - Wikipedia; PROD_ID: RES-09117
R4 R5 = SparkFun-Resistors:75KOHM: 75Ω resistor A resistor is a passive two-terminal electrical component that implements electrical resistance as a circuit element. Resistors act to reduce current flow, and, at the same time, act to lower voltage levels within circuits. - Wikipedia; PROD_ID: RES-09737; VALUE: 75
S1 S2 = SparkFun-Switches:MOMENTARY-SWITCH-SPST: Momentary Switch (Pushbutton) - SPST Normally-open (NO) SPST momentary switches (buttons, pushbuttons). Variants PTH-12MM - 12mm square, through-hole Momentary Pushbutton Switch - 12mm Square <https://www.sparkfun.com/products/9190> (COM-09190) PTH-6.0MM, PTH-6.0MM-KIT - 6.0mm square, through-hole Mini Pushbutton Switch <https://www.sparkfun.com/products/97> (COM-00097) KIT package intended for soldering kit's - only one side of pads' copper is exposed. PTH-RIGHT-ANGLE-KIT - Right-angle, through-hole Right Angle Tactile Button <https://www.sparkfun.com/products/10791> - Used on SparkFun BigTime Watch Kit <https://www.sparkfun.com/products/11734> SMD-12MM - 12mm square, surface-mount Tactile Button - SMD (12mm) <https://www.sparkfun.com/products/12993> (COM-12993) Used on SparkFun PicoBoard <https://www.sparkfun.com/products/11888> SMD-4.5MM - 4.5mm Square Trackball Switch Used on SparkFun Blackberry Trackballer Breakout <https://www.sparkfun.com/products/13169> SMD-4.6MMX2.8MM - 4.60mm x 2.80mm, surface mount Used on SparkFun SAMD21 Mini Breakout <https://www.sparkfun.com/products/13664> SMD-5.2MM, SMD-5.2-REDUNDANT - 5.2mm square, surface-mount Mini Pushbutton Switch - SMD <https://www.sparkfun.com/products/8720> (COM-08720) Used on Arduino Pro Mini <https://www.sparkfun.com/products/11114> REDUNDANT package connects both switch circuits together SMD-6.0X3.5MM - 6.0 x 3.5mm, surface mount Momentary Reset Switch SMD <https://www.sparkfun.com/products/8229> (COM-08229) SMD-6.2MM-TALL - 6.2mm square, surface mount Tactile Button - SMD (6mm) <https://www.sparkfun.com/products/12992> Used on SparkFun Digital Sandbox <https://www.sparkfun.com/products/12651> SMD-RIGHT-ANGLE - Right-angle, surface mount Used on SparkFun Block for Intel® Edison - Arduino <https://www.sparkfun.com/products/13036>; PROD_ID: SWCH-14139
S-EQL S_0 S_1-S_9 S_A S_B S_BSL S_BSP S_C S_CB S_COM S_CPS S_D S_DOT S_E S_ENT S_ESC S_F S_FN1 S_FSL S_G S_H S_I S_J S_K S_L S_LAL S_LCT S_LGU S_LSH S_M S_MIN S_N S_O S_OB S_P S_Q S_QUO S_R S_RAL S_RCT S_RGU S_RSH S_S S_SCL S_SPC S_T S_TAB S_U S_V S_W S_X S_Y S_Z = ts_keyboards:MX-5-PIN-HOTSWAP-PAD
SA1-SA3 SC2 = ts_keyboards:MOUNTING-HOLE-WIDE
SC1 = ts_keyboards:MOUNTING-HOLE
SG1 SG4 = ts_keyboards:MOUNTING-HOLE-VWIDE
TVS = ts_keyboards:TVS_SMF9.0CA
U1 = SparkFun-IC-Power:V_REG_LM1117: Voltage Regulator LM1117 Standard adjustable voltage regulator but in SMD form. Spark Fun Electronics SKU : COM-00595; PROD_ID: VREG-08170
U$5 = random_logos:SPARKFUN_LOGO
U$6 = random_logos:QMK_LOGO
U$8 = random_logos:TECSMITH-LOGO
X1 = ts_keyboards:USB_C: USB Type-C USB 2.0 Connector
Z1-Z13 Z16-Z27 Z30-Z40 Z43-Z52 = ts_keyboards:MX-FPRINT-100U
Z14 = ts_keyboards:MX-FPRINT-200U
Z15 Z28 = ts_keyboards:MX-FPRINT-150U
Z29 = ts_keyboards:MX-FPRINT-175U
Z41 Z42 = ts_keyboards:MX-FPRINT-225U
Z53 = ts_keyboards:MX-FPRINT-275U
Z54-Z56 Z58-Z61 = ts_keyboards:MX-FPRINT-125U
Z57 = ts_keyboards:MX-FPRINT-625U

## Net classes
0 default: width 0 mm, drill 0 mm